# Altium schematic sheet SPort_SBUS.SchDoc
size A
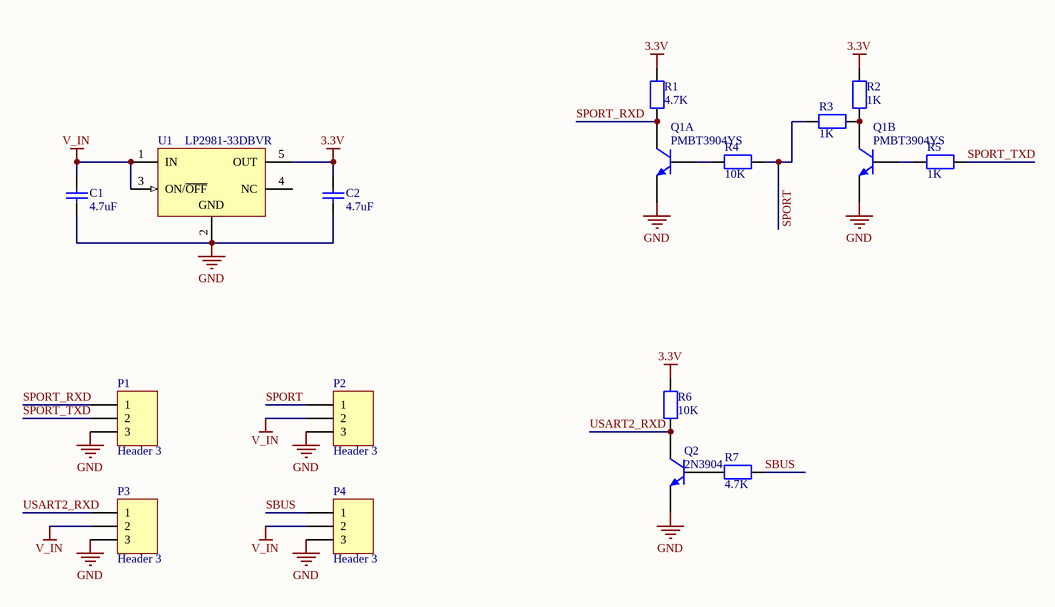
[diagram p0: SPort_SBUS.SchDoc]

## Parts
C1  value 4.7uF  [0603_CAP]  (hidden comment: Capacitor)
C2  value 4.7uF  [0603_CAP]  (hidden comment: Capacitor)
P1  Header 3  [Header_3]
P2  Header 3  [Header_3]
P3  Header 3  [Header_3]
P4  Header 3  [Header_3]
Q1  PMBT3904YS  [SOT363 (SC-88)]  (parts A,B of 2)
Q2  2N3904  [SOT95P240X120-3M]
R1  value 4.7K  [0603_RES]  (hidden comment: Resitor)
R2  value 1K  [0603_RES]  (hidden comment: Resitor)
R3  value 1K  [0603_RES]  (hidden comment: Resitor)
R4  value 10K  [0603_RES]  (hidden comment: Resitor)
R5  value 1K  [0603_RES]  (hidden comment: Resitor)
R6  value 10K  [0603_RES]  (hidden comment: Resitor)
R7  value 4.7K  [0603_RES]  (hidden comment: Resitor)
U1  LP2981-33DBVR  [MF05A_M]

## Nets
3.3V: C2.2 R1.1 R2.2 R6.2 U1.5(OUT)
GND: C1.1 C2.1 P1.3 P2.3 P3.3 P4.3 Q1.1(E) Q1.4(E) Q2.1(E) U1.2(GND)
V_IN: C1.2 P2.2 P3.2 P4.2 U1.1(IN) U1.3(ON/~{OFF})
SBUS: P4.1 R7.2
SPORT: P2.1 R3.2 R4.2
SPORT_RXD: P1.1 Q1.6(C) R1.2
SPORT_TXD: P1.2 R5.2
USART2_RXD: P3.1 Q2.3(C) R6.1
NetQ1_2: Q1.2(B) R4.1
NetQ1_3: Q1.3(C) R2.1 R3.1
NetQ1_5: Q1.5(B) R5.1
NetQ2_2: Q2.2(B) R7.1

Not connected (* = marked no-connect by the designer): U1 4(NC)

## Library data of the parts
C1 C2 = Capacitor: Max_V: 25V
P1-P4 = Header 3: Header, 3-Pin; LatestRevisionDate: 17-Jul-2002; LatestRevisionNote: Re-released for DXP Platform.; Publisher: Altium Limited
Q2 = 2N3904: NPN General Purpose Amplifier; Published: 8-Jun-2000; LatestRevisionDate: 15-Jan-2003; LatestRevisionNote: PCB Footprint 'BCY-W3/D4.7' replaced; DatasheetVersion: 1997; PackageVersion: Sep-1998; PackageReference: TO-92A; Publisher: Altium Limited; PackageDescription: TO, Flat Index; 3 In-Line, Axial Leads; Body Dia. 4.5mm; Leads 0.51 x 0.48 mm (max); ComponentLink1Description: Manufacturer Link; ComponentLink1URL: http://www.fairchildsemi.com/; ComponentLink2Description: Datasheet; ComponentLink2URL: http://www.fairchildsemi.com/ds/2N%2F2N3904.pdf
U1 = CMP-0062-02157-2: Micropower 100 mA Ultra Low-Dropout Regulator, 5-pin SOT-23; Manufacturer: National Semiconductor; PowerWise: N; PackageTopMarking: L04A*XTT; CompType: LDO IC; ComponentLink3URL: http://www.national.com/packaging/folders/mf05a.html; PackageDescription: Molded SOT-23, .115 x .063 x .040 in Body, 5 Lead, .0375 in Pitch; ComponentLink2Description: LP2981 Web Page; ComponentLink1Description: LP2981 Datasheet; DatasheetVersion: Feb-2006; PackageReference: MF05A; PackageVersion: revD, Aug-2008; ComponentLink2URL: http://www.national.com/pf/LP/LP2981.html; ComponentLink1URL: http://www.national.com/ds/LP/LP2981.pdf; PinCount: 5; RevisionNote: Component URLs added; ComponentLink3Description: MF05A Package Page; RoHS: N
Q1 = PMBT3904YS: ComponentLink1Description: Datasheet; ComponentLink1URL: http://www.nxp.com/documents/data_sheet/PMBT3904YS.pdf; Supplier 1: Digi-Key; Supplier 2: Farnell; Supplier Part Number 1: 568-6489-2-ND; Supplier Part Number 2: 2069534